# Altium schematic sheet EtherWiz_Controller.SchDoc
size A3; SheetNumber: 2; SheetTotal: 3
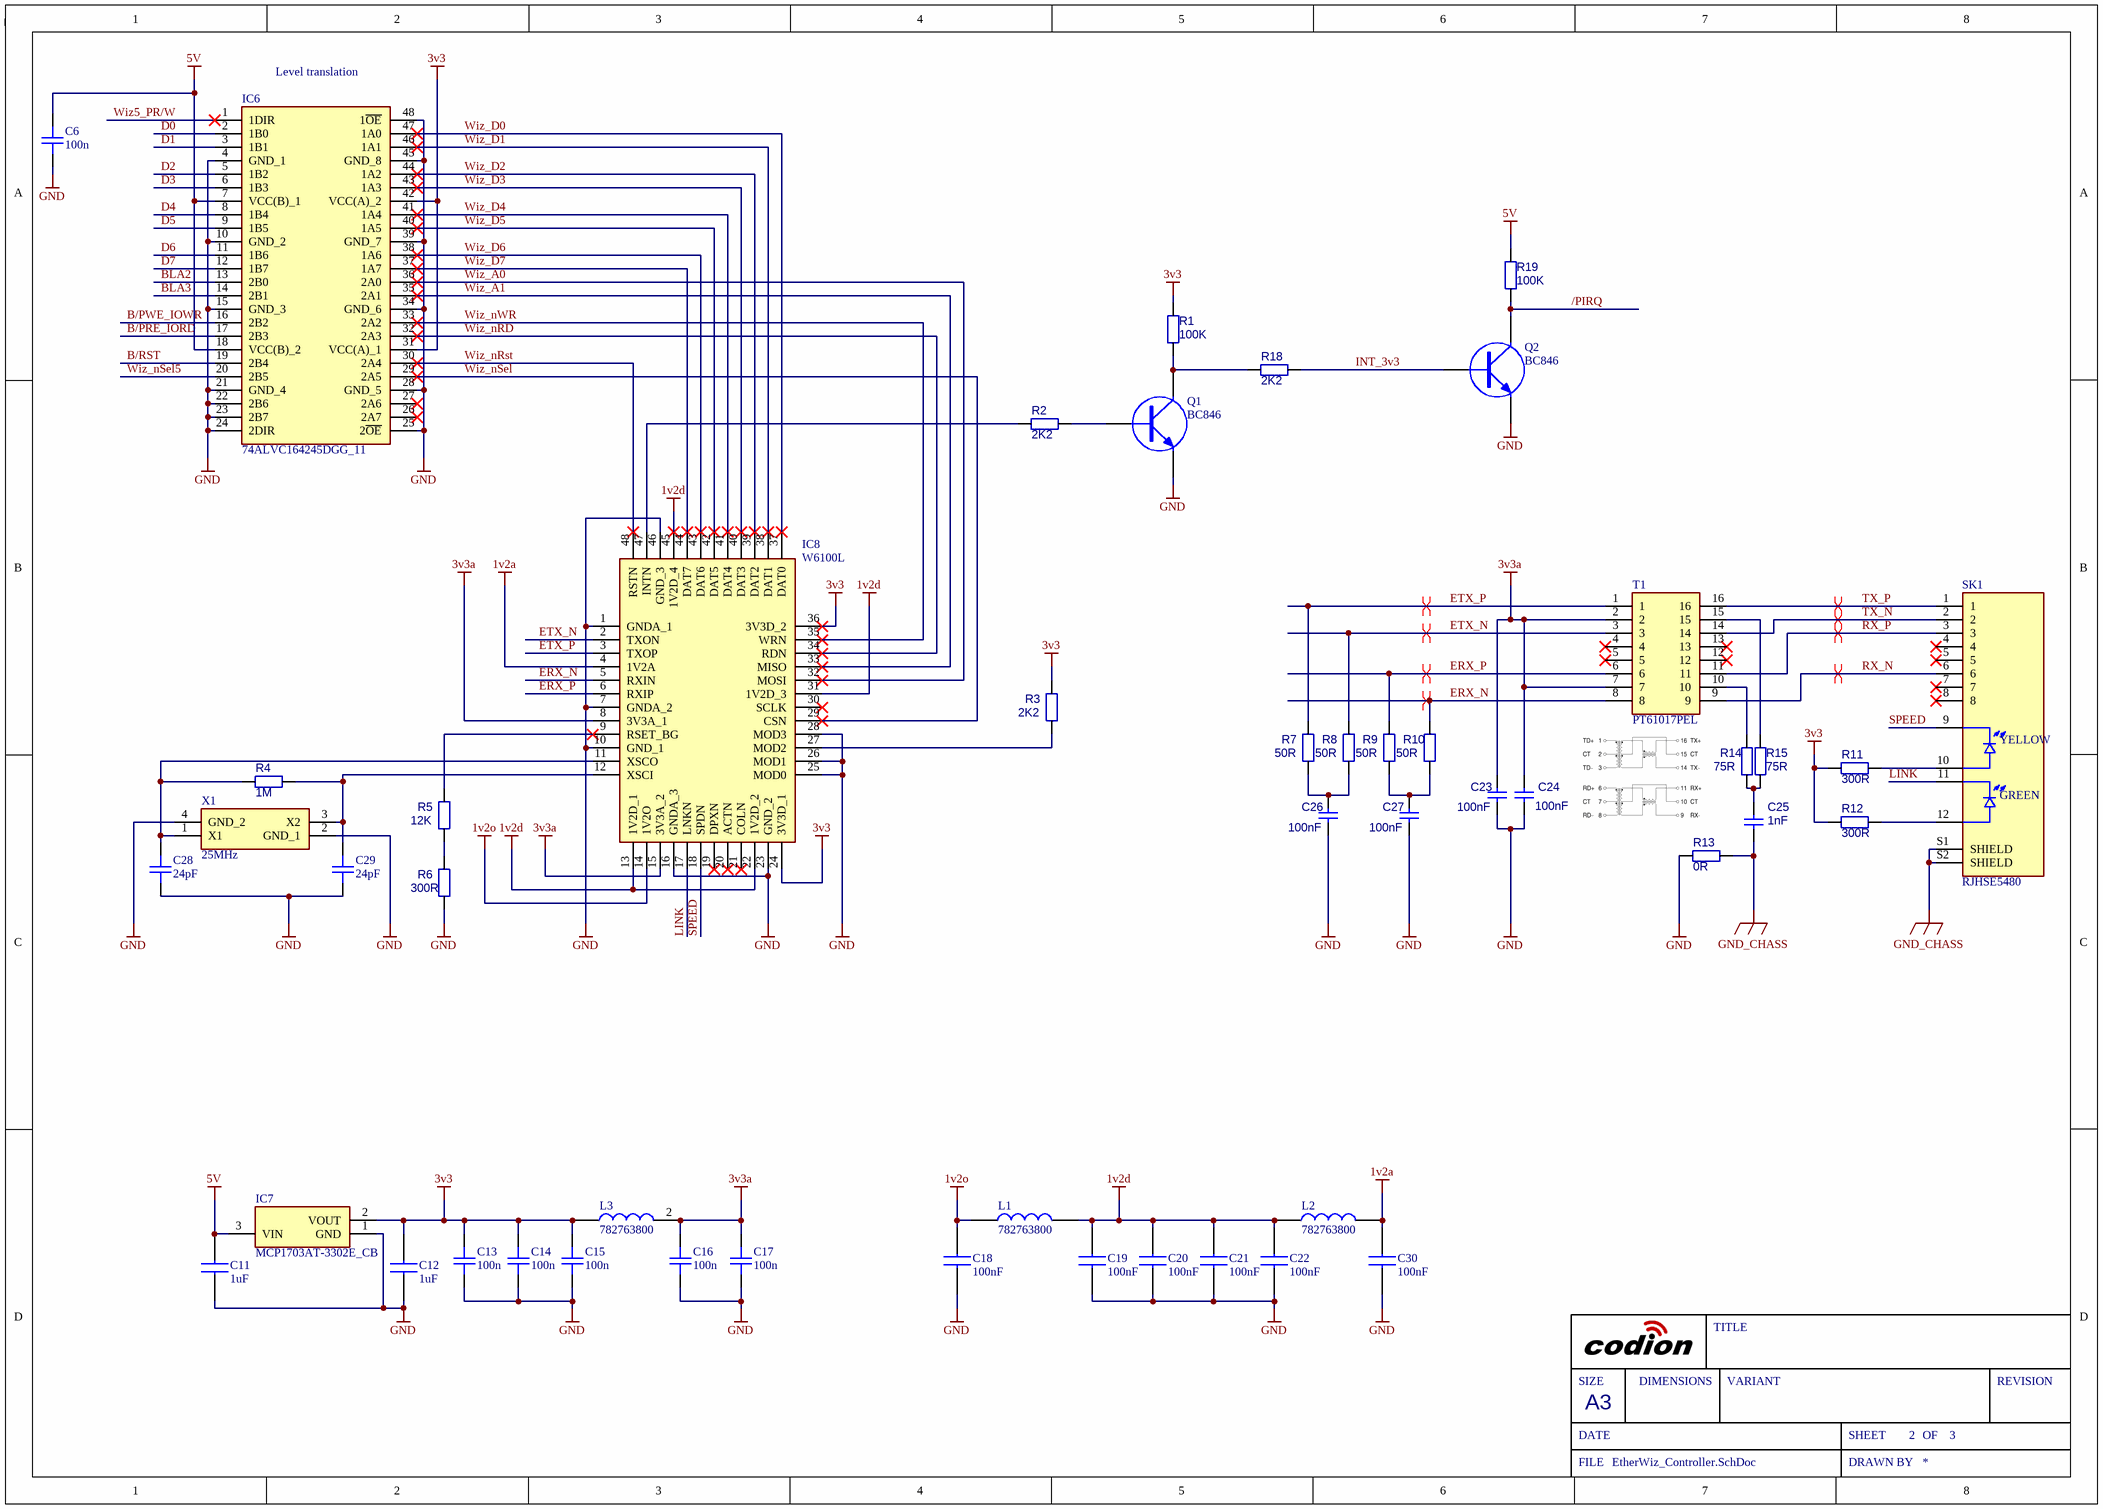
[diagram p0: EtherWiz_Controller.SchDoc]

## Parts
C6  100n  [CAPC1608L]
C11  1uF  [CAPC1608X90N]
C12  1uF  [CAPC1608X90N]
C13  100n  [CAPC1608L]
C14  100n  [CAPC1608L]
C15  100n  [CAPC1608L]
C16  100n  [CAPC1608L]
C17  100n  [CAPC1608L]
C18  100nF  [CAPC1608L]
C19  100nF  [CAPC1608L]
C20  100nF  [CAPC1608L]
C21  100nF  [CAPC1608L]
C22  100nF  [CAPC1608L]
C23  100nF  [CAPC1608L]
C24  100nF  [CAPC1608L]
C25  1nF  [CAPC1608L]
C26  100nF  [CAPC1608L]
C27  100nF  [CAPC1608L]
C28  24pF  [CAPC1608L]
C29  24pF  [CAPC1608L]
C30  100nF  [CAPC1608L]
IC6  74ALVC164245DGG_11  [SOP50P810X120-48N]
IC7  MCP1703AT-3302E_CB  [SOT95P255X145-3N]
IC8  W6100L  [QFP50P900X900X160-48N]
L1  782763800  [INDC3216X130N]
L2  782763800  [INDC3216X130N]
L3  782763800  [INDC3216X130N]
Q1  BC846  [SOT-23]
Q2  BC846  [SOT-23]
R1  100K  [RESC1608X50N]
R2  2K2  [RESC1608X50N]
R3  2K2  [RESC1608X50N]
R4  1M  [RESC1608X50N]
R5  12K  [RESC1608X50N]
R6  300R  [RESC1608X50N]
R7  50R  [RESC1608X50N]
R8  50R  [RESC1608X50N]
R9  50R  [RESC1608X50N]
R10  50R  [RESC1608X50N]
R11  300R  [RESC1608X50N]
R12  300R  [RESC1608X50N]
R13  0R  [RESC1608L]
R14  75R  [RESC1608L]
R15  75R  [RESC1608L]
R18  2K2  [RESC1608X50N]
R19  100K  [RESC1608X50N]
SK1  RJHSE5480  [AMPHENOL_RJHSE5480]
T1  PT61017PEL  [PT61017PEL]
X1  25MHz  [ABM810000MHZ12D2W]

## Nets
1v2a: C30.2 IC8.4(1V2A) L2.2
1v2d: C19.2 C20.2 C21.2 C22.2 IC8.13(1V2D_1) IC8.22(1V2D_2) IC8.31(1V2D_3) IC8.45(1V2D_4) L1.2 L2.1
1v2o: C18.2 IC8.14(1V2O) L1.1
3v3: C12.2 C13.2 C14.2 C15.2 IC6.31(VCC(A)_1) IC6.42(VCC(A)_2) IC7.2(VOUT) IC8.24(3V3D_1) IC8.36(3V3D_2) L3.1 R1.2 R3.2 R11.2 R12.2
3v3a: C16.2 C17.2 C23.2 C24.2 IC8.8(3V3A_1) IC8.15(3V3A_2) L3.2 T1.2 T1.7
5V: C6.2 C11.2 IC6.7(VCC(B)_1) IC6.18(VCC(B)_2) IC7.3(VIN) R19.2
GND: C6.1 C11.1 C12.1 C13.1 C14.1 C15.1 C16.1 C17.1 C18.1 C19.1 C20.1 C21.1 C22.1 C23.1 C24.1 C26.1 C27.1 C28.1 C29.1 C30.1 IC6.4(GND_1) IC6.10(GND_2) IC6.15(GND_3) IC6.21(GND_4) IC6.22(2B6) IC6.23(2B7) IC6.24(2DIR) IC6.25(2~{OE}) IC6.28(GND_5) IC6.34(GND_6) IC6.39(GND_7) IC6.45(GND_8) IC6.48(1~{OE}) IC7.1(GND) IC8.1(GNDA_1) IC8.7(GNDA_2) IC8.10(GND_1) IC8.16(GNDA_3) IC8.23(GND_2) IC8.25(MOD0) IC8.26(MOD1) IC8.28(MOD3) IC8.46(GND_3) Q1.2(E) Q2.2(E) R6.1 R13.1 X1.2(GND_1) X1.4(GND_2)
GND_CHASS: C25.1 R13.2 SK1.S1(SHIELD) SK1.S2(SHIELD)
/PIRQ: Q2.3(C) R19.1
B/PRE_IORD: IC6.17(2B3)
B/PWE_IOWR: IC6.16(2B2)
B/RST: IC6.19(2B4)
BLA2: IC6.13(2B0)
BLA3: IC6.14(2B1)
D0: IC6.2(1B0)
D1: IC6.3(1B1)
D2: IC6.5(1B2)
D3: IC6.6(1B3)
D4: IC6.8(1B4)
D5: IC6.9(1B5)
D6: IC6.11(1B6)
D7: IC6.12(1B7)
ERX_N: IC8.5(RXIN) R10.2 T1.8
ERX_P: IC8.6(RXIP) R9.2 T1.6
ETX_N: IC8.2(TXON) R8.2 T1.3
ETX_P: IC8.3(TXOP) R7.2 T1.1
INT_3v3: Q2.1(B) R18.2
LINK: IC8.17(LNKN) SK1.11
RX_N: SK1.6 T1.9
RX_P: SK1.3 T1.11
SPEED: IC8.18(SPDN) SK1.9
TX_N: SK1.2 T1.14
TX_P: SK1.1 T1.16
Wiz5_PR/W: IC6.1(1DIR)
Wiz_A0: IC6.36(2A0) IC8.32(MOSI)
Wiz_A1: IC6.35(2A1) IC8.33(MISO)
Wiz_D0: IC6.47(1A0) IC8.37(DAT0)
Wiz_D1: IC6.46(1A1) IC8.38(DAT1)
Wiz_D2: IC6.44(1A2) IC8.39(DAT2)
Wiz_D3: IC6.43(1A3) IC8.40(DAT3)
Wiz_D4: IC6.41(1A4) IC8.41(DAT4)
Wiz_D5: IC6.40(1A5) IC8.42(DAT5)
Wiz_D6: IC6.38(1A6) IC8.43(DAT6)
Wiz_D7: IC6.37(1A7) IC8.44(DAT7)
Wiz_nRD: IC6.32(2A3) IC8.34(RDN)
Wiz_nRst: IC6.30(2A4) IC8.48(RSTN)
Wiz_nSel: IC6.29(2A5) IC8.29(CSN)
Wiz_nSel5: IC6.20(2B5)
Wiz_nWR: IC6.33(2A2) IC8.35(WRN)
NetC25_2: C25.2 R14.1 R15.1
NetC26_2: C26.2 R7.1 R8.1
NetC27_2: C27.2 R9.1 R10.1
NetC28_2: C28.2 IC8.11(XSCO) R4.2 X1.1(X1)
NetC29_2: C29.2 IC8.12(XSCI) R4.1 X1.3(X2)
NetIC8_9: IC8.9(RSET_BG) R5.2
NetIC8_27: IC8.27(MOD2) R3.1
NetIC8_47: IC8.47(INTN) R2.1
NetQ1_1: Q1.1(B) R2.2
NetQ1_3: Q1.3(C) R1.1 R18.1
NetR5_1: R5.1 R6.2
NetR11_1: R11.1 SK1.10
NetR12_1: R12.1 SK1.12
NetR14_2: R14.2 T1.10
NetR15_2: R15.2 T1.15

Not connected (* = marked no-connect by the designer): IC6 26(2A7)* 27(2A6)*; IC8 19(DPXN)* 20(ACTN)* 21(COLN)* 30(SCLK)*; SK1 4* 5* 7* 8*; T1 4* 5* 12* 13*

## Layout directives
differential pair: ERX_N, ERX_P, ETX_N, ETX_P, RX_N, RX_P, TX_N, TX_P

## Notes on the sheet
- (near IC6) Level translation
- SIZE
- DIMENSIONS
- TITLE
- VARIANT
- REVISION
- DATE
- A3
- SHEET
- OF
- FILE
- DRAWN BY
- (in symbol RJHSE5480) YELLOW; GREEN

## Library data of the parts
C6 C13-C17 = CAP_100n_0603_50V_0: CAP 100nF, 0603, 50V, X7R, 10%; Manufacturer1: Samsung; ManuPart1: CL10B104KB8NNNC; ManuPart2: CC0603KRX7R9BB104; Value: 100n; Distributor1: Anglia; Manufacturer2: Yageo; Distributor2: Digikey; Distributor1 Part No: CL10B104KB8NNNC; Distributor2 Part No: 311-1344-2-ND; ComponentLinknURL: *; ComponentLink1Description: ComponentLinknURL1; ComponentLink1URL: https://media.digikey.com/pdf/Data%20Sheets/Samsung%20PDFs/CL_Series_MLCC_ds.pdf; ComponentLink2Description: ComponentLinknURL2; ComponentLink2URL: https://www.yageo.com/upload/media/product/productsearch/datasheet/mlcc/UPY-GPHC_X7R_6.3V-to-50V_18.pdf; Voltage: 50V
C11 C12 = CL10A105KP8NNNC: Capacitor; Manufacturer_Name: SAMSUNG; Datasheet Link: https://datasheet.lcsc.com/szlcsc/Samsung-Electro-Mechanics-CL10A105KP8NNNC_C26413.pdf; Height: 0.9mm; Manufacturer_Part_Number: CL10A105KP8NNNC; Mouser Part Number: 187-CL10A105KP8NNNC; Mouser Price/Stock: https://www.mouser.co.uk/ProductDetail/Samsung-Electro-Mechanics/CL10A105KP8NNNC?qs=349EhDEZ59qtu6tL%2F73n2A%3D%3D; Arrow Part Number: CL10A105KP8NNNC; Arrow Price/Stock: https://www.arrow.com/en/products/cl10a105kp8nnnc/samsung-electro-mechanics?utm_currency=USD&region=nac
C18-C22 C30 = 100nF0805: Capacitor; Manufacturer_Name: TDK; Manufacturer_Part_Number: C2012X7R1H104K125AM; Datasheet Link: https://product.tdk.com/info/en/catalog/datasheets/mlcc_commercial_midvoltage_en.pdf; Height: 1.45mm; Mouser Part Number: 810-C2012X7R1H104KT5; Mouser Price/Stock: https://www.mouser.com/Search/Refine.aspx?Keyword=810-C2012X7R1H104KT5; Arrow Part Number: C2012X7R1H104K125AM; Arrow Price/Stock: https://www.arrow.com/en/products/c2012x7r1h104k125am/tdk; LCSC Part #: C111492
C23 C24 C26 C27 = 909-0001-L: Cap ceramic X7R/X5R 100nF 10% 16V C0603; Manufacturer: EPCOS; ManuPart: B37931-K9104-K60; Qualified2ndPart: CC0603KRX7R7BB104; Disti Part Number: 432-210; Tolerance: 0.1; Qualified2ndManu: Yageo; Cost(£): 0.038; Value: 100nF; Construction: X7R; Voltage: 16V; Simulation: CAP; Distributer: Farnell; RoHS Compliant: YES; Component Type: Standard; LCSC Part #: C66501
C25 = 910-0053-L: Cap ceramic X7R 1nF 10% 2kV C1206; Manufacturer: AVX; ManuPart: 1206GC102KAT1A; Tolerance: 0.1; Voltage: 2000V; Cost(£): 0.187; Value: 1nF; Construction: X7R; Simulation: CAP; Distributer: Anglia; Disti Part Number: 1206GC102KAT1A; RoHS Compliant: YES; Component Type: Standard; LCSC Part #: C23631
C28 C29 = CAP_10P_0603_50V_0: CAP 10PF, 0603, 50V, NP0, 10%; Value: 24pF; ComponentLinknURL: *
IC6 = 74ALVC164245DGG_11: Integrated Circuit; Manufacturer_Name: Nexperia; Manufacturer_Part_Number: 74ALVC164245DGG:11; Datasheet Link: https://assets.nexperia.com/documents/data-sheet/74ALVC164245.pdf; Height: 1.2mm; Mouser Part Number: 771-74ALVC164245; Mouser Price/Stock: https://www.mouser.co.uk/ProductDetail/Nexperia/74ALVC164245DGG11?qs=odJ8N4Y39o4j0ykFPcnqaQ%3D%3D; Arrow Part Number: 74ALVC164245DGG:11; Arrow Price/Stock: https://www.arrow.com/en/products/74alvc164245dgg11/nexperia?utm_currency=USD&region=nac
IC7 = MCP1703AT-3302E_CB: Integrated Circuit; Manufacturer_Name: Microchip; Manufacturer_Part_Number: MCP1703AT-3302E/CB; Datasheet Link: http://uk.rs-online.com/web/p/products/7709509; Height: 1.45mm; Mouser Part Number: 579-MCP1703AT3302ECB; Mouser Price/Stock: https://www.mouser.co.uk/ProductDetail/Microchip-Technology/MCP1703AT-3302E-CB?qs=PZkJWYMe7leeY97bgTp%252B9w%3D%3D; Arrow Part Number: MCP1703AT-3302E/CB; Arrow Price/Stock: https://www.arrow.com/en/products/mcp1703at-3302ecb/microchip-technology?region=nac
IC8 = W6100L: Integrated Circuit; Manufacturer_Name: WIZnet Inc; Datasheet Link: https://eu.mouser.com/datasheet/2/443/w6100_ds_v104e-1994614.pdf; Height: 1.6mm; Manufacturer_Part_Number: W6100L; Mouser Part Number: 950-W6100L; Mouser Price/Stock: https://www.mouser.co.uk/ProductDetail/WIZnet/W6100L?qs=pUKx8fyJudARLmbJE2EKlA%3D%3D
L1-L3 = 74279215: Inductor; Manufacturer_Name: Wurth Elektronik; Datasheet Link: http://componentsearchengine.com/Datasheets/1/74279215.pdf; Height: 1.3mm; Manufacturer_Part_Number: 782763800; Mouser Part Number: 710-782763800; Mouser Price/Stock: https://www.mouser.co.uk/ProductDetail/Wurth-Elektronik/74279215?qs=5twSNpOB8IC%252BebnV0jQtuw%3D%3D
Q1 Q2 = TRANS_NPN_BC846_0: Transistor NPN, 65V, 100mA, TO-236AB/SOT23; Value: BC846; ComponentLinknURL: *
R1 R19 = 920-0030-L: Resistor 100K 1%  0603; Value: 100K
R2 R3 R18 = 920-0030-L: Resistor 2K2 1%  0603; Manufacturer: Multicomp; ManuPart: MCWR06X75R0FTL; Disti Part Number: 2447434; Tolerance: 0.01; Power: 63mW; Cost(£): 0.025; Value: 2K2; Construction: Thick Film; Simulation: RES; Distributer: Farnell; RoHS Compliant: YES; Component Type: Standard; LCSC Part #: C127449
R4 = 920-0030-L: Resistor 1M 1%  0603; Manufacturer: Multicomp; ManuPart: MCWR06X75R0FTL; Disti Part Number: 2447434; Tolerance: 0.01; Power: 63mW; Cost(£): 0.025; Value: 1M; Construction: Thick Film; Simulation: RES; Distributer: Farnell; RoHS Compliant: YES; Component Type: Standard; LCSC Part #: C127449
R5 = 920-0030-L: Resistor 12K 1%  0603; Manufacturer: Multicomp; ManuPart: MCWR06X75R0FTL; Disti Part Number: 2447434; Tolerance: 0.01; Power: 63mW; Cost(£): 0.025; Value: 12K; Construction: Thick Film; Simulation: RES; Distributer: Farnell; RoHS Compliant: YES; Component Type: Standard; LCSC Part #: C127449
R6 = 920-0030-L: Resistor 300R 1%  0603; Manufacturer: Multicomp; ManuPart: MCWR06X75R0FTL; Disti Part Number: 2447434; Tolerance: 0.01; Power: 63mW; Cost(£): 0.025; Value: 300R; Construction: Thick Film; Simulation: RES; Distributer: Farnell; RoHS Compliant: YES; Component Type: Standard; LCSC Part #: C127449
R7-R10 = 920-0030-L: Resistor 50R 1%  0603; Manufacturer: Multicomp; ManuPart: MCWR06X75R0FTL; Disti Part Number: 2447434; Tolerance: 0.01; Power: 63mW; Cost(£): 0.025; Value: 50R; Construction: Thick Film; Simulation: RES; Distributer: Farnell; RoHS Compliant: YES; Component Type: Standard; LCSC Part #: C127449
R11 R12 = 920-0030-L: Resistor 300R 1%  0603; Value: 300R
R13 = 920-0001-L: Resistor 0R0 1A Max 0603; Manufacturer: Vishay; ManuPart: CRCW06030000Z0EA; Qualified2ndPart: RC0603JR-070RL; Disti Part Number: 923-3130; Qualified2ndManu: Yageo; Cost(£): 0.056; Value: 0R; Construction: Thick Film; Simulation: RES; Distributer: Farnell; RoHS Compliant: YES; Component Type: Standard; LCSC Part #: C844718
R14 R15 = 920-0030-L: Resistor 75R 1%  0603; Manufacturer: Multicomp; ManuPart: MCWR06X75R0FTL; Disti Part Number: 2447434; Tolerance: 0.01; Power: 63mW; Cost(£): 0.025; Value: 75R; Construction: Thick Film; Simulation: RES; Distributer: Farnell; RoHS Compliant: YES; Component Type: Standard; LCSC Part #: C127449
SK1 = RJHSE5480: Ethernet socket - through hole; Manufacturer: Amphenol; Disti Part Number: 2709018; ManuPart: RJHSE-5480; Value: *; Distributer: Farnell
T1 = PT61017PEL: Transformer; Manufacturer: Bourns; Disti Part Number: 652-PT61017PEL; Datasheet Link: http://www.bourns.com/docs/Product-Datasheets/pt61017pel.pdf; Height: 5mm; ManuPart: PT61017PEL; Mouser Price/Stock: https://www.mouser.co.uk/ProductDetail/Bourns/PT61017PEL?qs=0rbOLB9uh%252BASY8PB9lbWrQ%3D%3D; Distributer: Mouser; Arrow Price/Stock: https://www.arrow.com/en/products/pt61017pel/bourns?region=europe; LCSC Part #: C124001
X1 = ABM8-25.000MHZ-D2X-T: Crystal or Oscillator; Manufacturer_Name: ABRACON; Datasheet Link: https://abracon.com/Resonators/abm8.pdf; Height: 0.8mm; Manufacturer_Part_Number: ABM8-25.000MHZ-D2X-T; Mouser Part Number: 815-ABM825MHZD2XT; Mouser Price/Stock: https://www.mouser.co.uk/ProductDetail/ABRACON/ABM8-25.000MHZ-D2X-T?qs=XeJtXLiO41RuPiM7CXbPRQ%3D%3D; Arrow Part Number: ABM8-25.000MHZ-D2X-T; Arrow Price/Stock: https://www.arrow.com/en/products/abm8-25.000mhz-d2x-t/abracon?region=nac